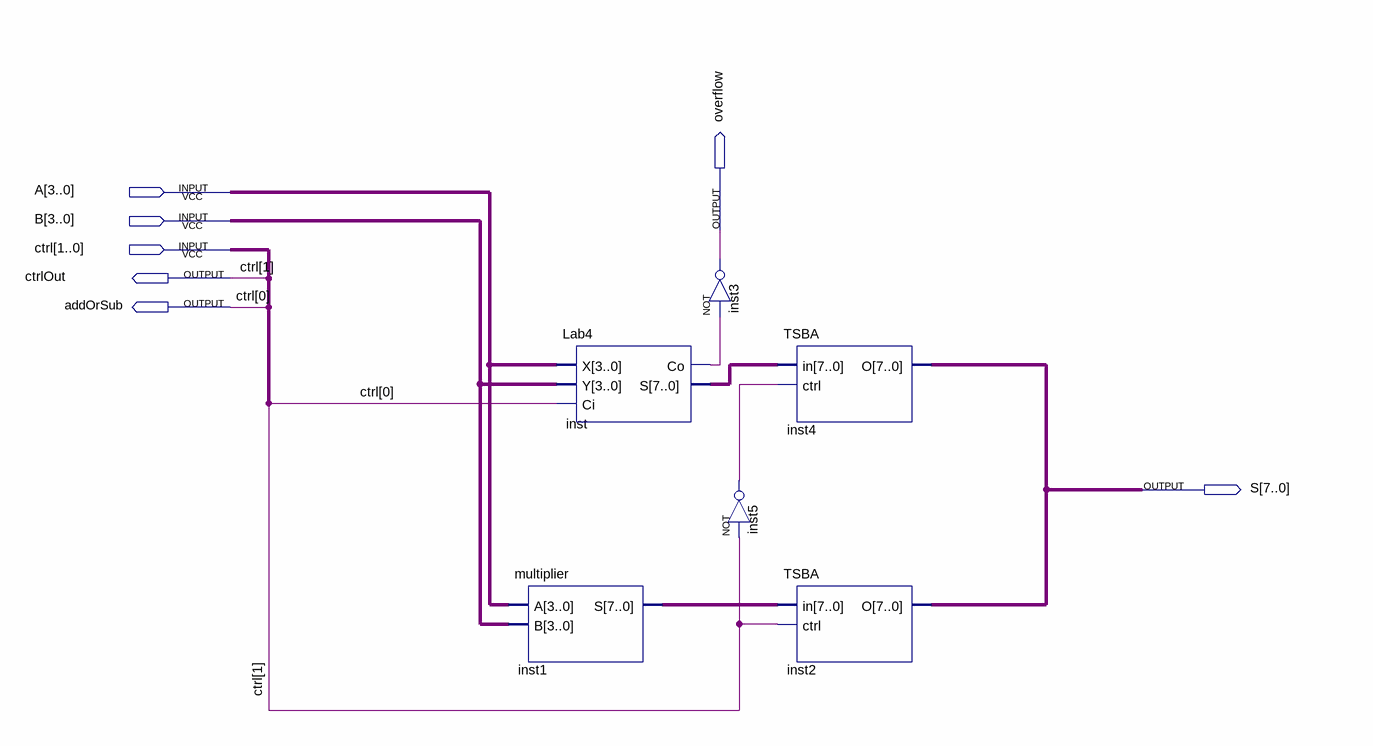
[diagram p0: schematic sheet]
// Quartus schematic lab5.bdf as structural Verilog: 6 symbols, 7 pins
module lab5 (
  input  [3:0] A,
  input  [3:0] B,
  input  [1:0] ctrl,
  output overflow,
  output ctrlOut,
  output addOrSub,
  output [7:0] S
);

  wire inst5_out, inst_co;
  wire [7:0] inst1_s, inst_s;

  multiplier inst1 (.A(A), .B(B), .S(inst1_s));
  Lab4 inst (.X(A), .Y(B), .Ci(ctrl[0]), .Co(inst_co), .S(inst_s));
  not inst3 (overflow, inst_co);
  not inst5 (inst5_out, ctrl[1]);
  TSBA inst4 (.in(inst_s), .ctrl(inst5_out), .O(S));
  TSBA inst2 (.in(inst1_s), .ctrl(ctrl[1]), .O(S));

  assign addOrSub = ctrl[0];
  assign ctrlOut = ctrl[1];
endmodule
